# EAGLE schematic CAN Module (EAGLE 6.5.0)
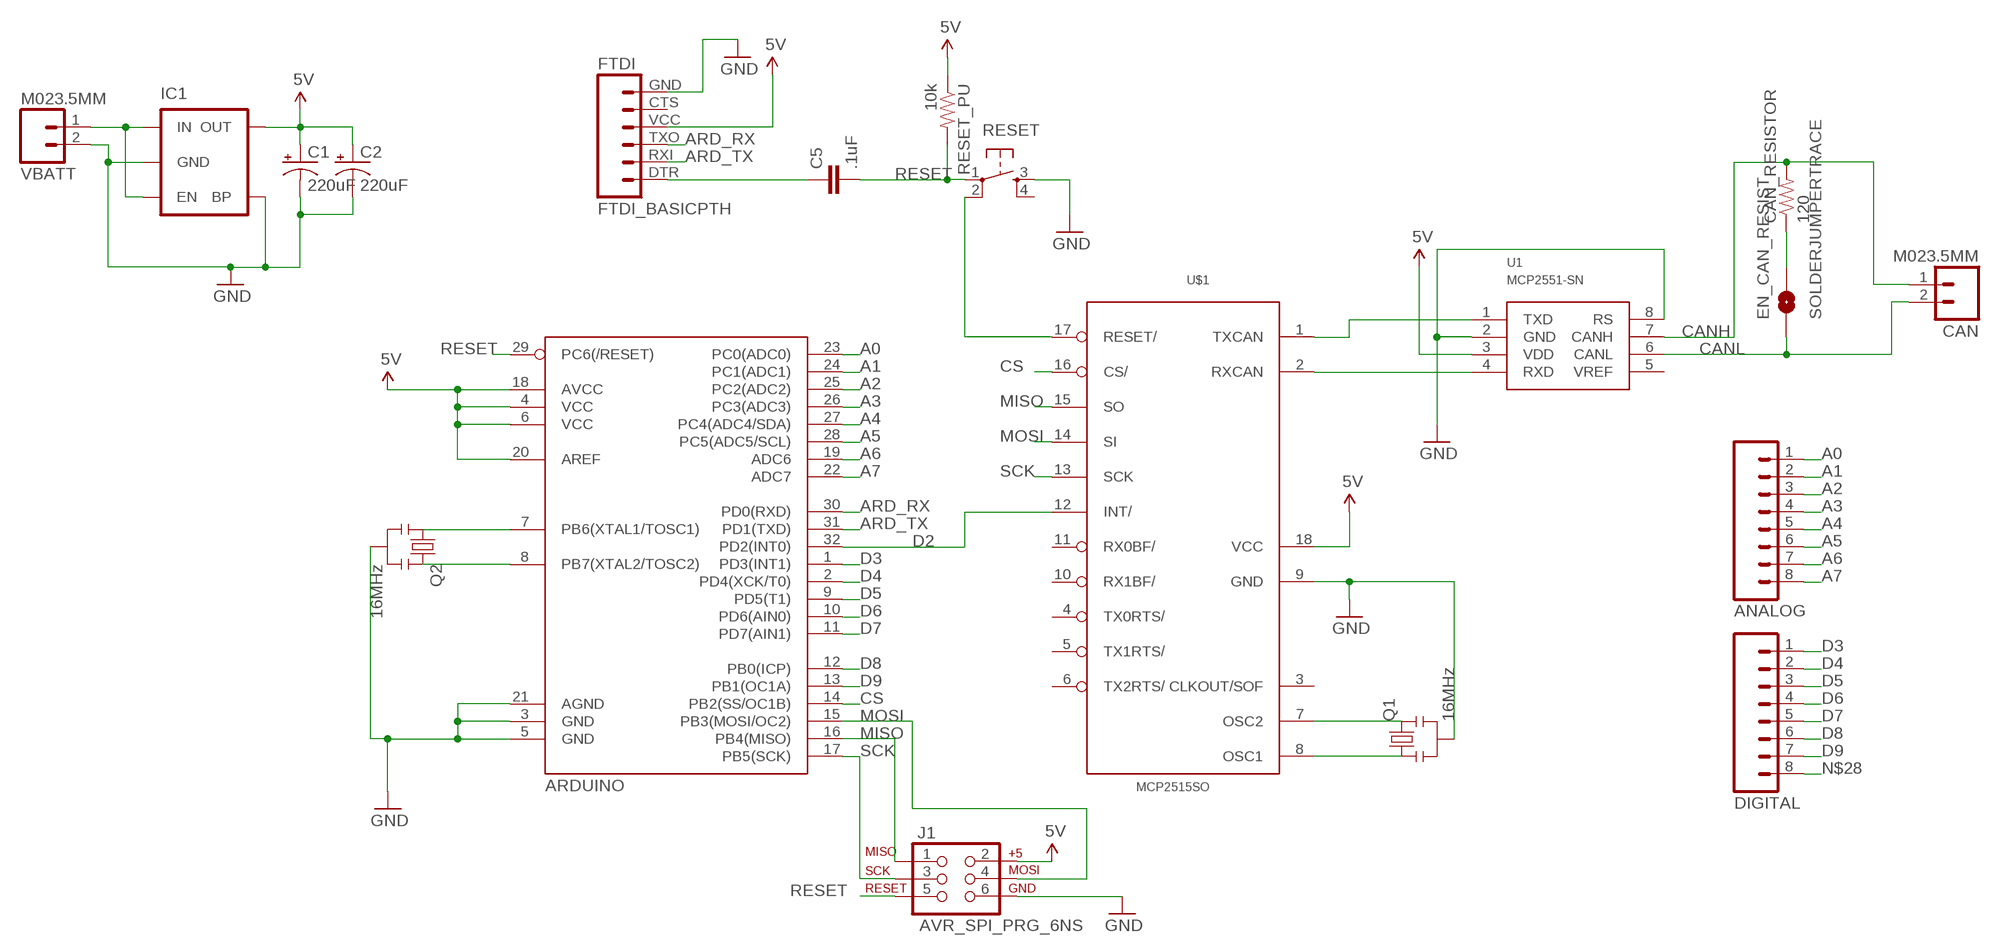
[diagram p0: schematic, sheet 1]

## Parts
ANALOG  M08LOCK  [1X08_LOCK]
ARDUINO  ATMEGA328_SMT  [TQFP32-08]
C1  220uF  CAP_POL1206-KIT  [EIA3216-KIT]
C2  220uF  CAP_POL1206-KIT  [EIA3216-KIT]
C5  .1uF  CAP0805  [0805]
CAN  M023.5MM  [SCREWTERMINAL-3.5MM-2]
CAN_RESISTOR  120  RESISTOR0805-RES  [0805]
DIGITAL  M08LOCK  [1X08_LOCK]
EN_CAN_RESIST  SOLDERJUMPERTRACE  [SJ_2S-TRACE]
FTDI  FTDI_BASICPTH  [FTDI_BASIC]
IC1  MIC52055V  [SOT23-5]
J1  AVR_SPI_PRG_6NS  [2X3-NS]
Q1  16MHz  RESONATOR16MHZ  [RESONATOR-SMD]
Q2  16MHz  RESONATOR16MHZ  [RESONATOR-SMD]
RESET  TAC_SWITCHSMD  [TACTILE_SWITCH_SMD]
RESET_PU  10k  RESISTOR0805-RES  [0805]
U1  MCP2551-SN  [SO-08]
U$1  MCP2515SO  [SO18L]
VBATT  M023.5MM  [SCREWTERMINAL-3.5MM-2]

## Nets
5V: ARDUINO.4(VCC) ARDUINO.6(VCC) ARDUINO.18(AVCC) ARDUINO.20(AREF) C1.A(+) C2.A(+) FTDI.VCC IC1.5(OUT) J1.2 RESET_PU.1 U1.3(VDD) U$1.18(VCC)
A0: ANALOG.1 ARDUINO.23(PC0(ADC0))
A1: ANALOG.2 ARDUINO.24(PC1(ADC1))
A2: ANALOG.3 ARDUINO.25(PC2(ADC2))
A3: ANALOG.4 ARDUINO.26(PC3(ADC3))
A4: ANALOG.5 ARDUINO.27(PC4(ADC4/SDA))
A5: ANALOG.6 ARDUINO.28(PC5(ADC5/SCL))
A6: ANALOG.7 ARDUINO.19(ADC6)
A7: ANALOG.8 ARDUINO.22(ADC7)
ARD_RX: ARDUINO.30(PD0(RXD)) FTDI.TXO
ARD_TX: ARDUINO.31(PD1(TXD)) FTDI.RXI
CANH: CAN.1 CAN_RESISTOR.2 U1.7(CANH)
CANL: CAN.2 EN_CAN_RESIST.1 U1.6(CANL)
CS: ARDUINO.14(PB2(SS/OC1B)) U$1.16(CS/)
D2: ARDUINO.32(PD2(INT0)) U$1.12(INT/)
D3: ARDUINO.1(PD3(INT1)) DIGITAL.1
D4: ARDUINO.2(PD4(XCK/T0)) DIGITAL.2
D5: ARDUINO.9(PD5(T1)) DIGITAL.3
D6: ARDUINO.10(PD6(AIN0)) DIGITAL.4
D7: ARDUINO.11(PD7(AIN1)) DIGITAL.5
D8: ARDUINO.12(PB0(ICP)) DIGITAL.6
D9: ARDUINO.13(PB1(OC1A)) DIGITAL.7
GND: ARDUINO.3(GND) ARDUINO.5(GND) ARDUINO.21(AGND) C1.C(-) C2.C(-) FTDI.GND IC1.2(GND) IC1.4(BP) J1.6 Q1.2 Q2.2 RESET.3 U1.2(GND) U1.8(RS) U$1.9(GND) VBATT.2
MISO: ARDUINO.16(PB4(MISO)) J1.1 U$1.15(SO)
MOSI: ARDUINO.15(PB3(MOSI/OC2)) J1.4 U$1.14(SI)
N$2: U1.4(RXD) U$1.2(RXCAN)
N$3: U1.1(TXD) U$1.1(TXCAN)
N$4: CAN_RESISTOR.1 EN_CAN_RESIST.2
N$8: RESET.2 U$1.17(RESET/)
N$9: ARDUINO.7(PB6(XTAL1/TOSC1)) Q2.1
N$10: ARDUINO.8(PB7(XTAL2/TOSC2)) Q2.3
N$11: C5.1 FTDI.DTR
N$12: Q1.3 U$1.7(OSC2)
N$13: Q1.1 U$1.8(OSC1)
N$14: IC1.1(IN) IC1.3(EN) VBATT.1
N$28: DIGITAL.8
RESET: ARDUINO.29(PC6(/RESET)) C5.2 J1.5 RESET.1 RESET_PU.2
SCK: ARDUINO.17(PB5(SCK)) J1.3 U$1.13(SCK)
Unconnected: FTDI.CTS RESET.4 U1.5(VREF) U$1.3(CLKOUT/SOF) U$1.4(TX0RTS/) U$1.5(TX1RTS/) U$1.6(TX2RTS/) U$1.10(RX1BF/) U$1.11(RX0BF/)

## Library data of the parts
ANALOG DIGITAL = SparkFun-Connectors:M08: Header 8 Standard 8-pin 0.1" header. Use with straight break away headers (SKU : PRT-00116), right angle break away headers (PRT-00553), swiss pins (PRT-00743), machine pins (PRT-00117), and female headers (PRT-00115).
ARDUINO = SparkFun-DigitalIC:ATMEGA328_SMT: 32-Pin Atmega328 part Commonly used on Arduino compatible boards Available in QFP and QFN packages TQFP is IC-09069 QFN is non-stock; PROD_ID: IC-09069; VALUE: ATMEGA328P
C1 C2 = SparkFun-Capacitors:CAP_POL: Capacitor Polarized These are standard SMD and PTH capacitors. Normally 10uF, 47uF, and 100uF in electrolytic and tantalum varieties. Always verify the external diameter of the through hole cap, it varies with capacity, voltage, and manufacturer. The EIA devices should be standard.
C5 = SparkFun-Capacitors:CAP: Capacitor Standard 0603 ceramic capacitor, and 0.1" leaded capacitor.
CAN VBATT = SparkFun-Connectors:M02: Standard 2-pin 0.1" header. Use with - straight break away headers ( PRT-00116) - right angle break away headers (PRT-00553) - swiss pins (PRT-00743) - machine pins (PRT-00117) - female headers (PRT-00115) Molex polarized connector foot print use with: PRT-08233 with associated crimp pins and housings. 2.54_SCREWTERM for use with PRT-10571. 3.5mm Screw Terminal footprints for PRT-08084 5mm Screw Terminal footprints for use with PRT-08433
CAN_RESISTOR RESET_PU = SparkFun-Resistors:RESISTOR: Resistor Basic schematic elements and footprints for 0603, 1206, and PTH resistors.
EN_CAN_RESIST = SparkFun-Passives:SOLDERJUMPER: Solder Jumper Standard SMD solder jumper. Used to automate production. Two varients : Normally Open and Normally Closed are the same, but have different paste layers. NC will have a large amount of paste and should jumper during reflow.
FTDI = SparkFun-Connectors:FTDI_BASIC: FTDI Basic header with labels
IC1 = SparkFun-PowerIC:MIC5205: MIC5205 150mA vreg 3.3V - VREG-00822 5V - VREG-00823; PROD_ID: VREG-00823
J1 = SparkFun-Connectors:AVR_SPI_PRG_6: AVR ISP 6 Pin This is the reduced ISP connector for AVR programming. Common on Arduino. This footprint will take up less PCB space and can be used with a 10-pin to 6-pin adapter such as SKU: BOB-08508
Q1 Q2 = SparkFun-FreqCtrl:RESONATOR: Resonator Small SMD resonator. Used, eg, on the Arduino Pro/ Pro Mini boards. 8MHz- XTAL-08895 16MHz- XTAL-08900; PROD_ID: XTAL-08900
RESET = SparkFun-Electromechanical:TAC_SWITCH: Momentary Switch Button commonly used for reset or general input. Spark Fun Electronics SKU : COM-00097 SMT- SWCH-08247; PROD_ID: SWCH-08247
U1 = MCP2551:MCP2551: Maciej Kalinowski maciek@chwarzno.pl
U$1 = MCP2515_MT:MCP2515*: MCP2515 Standalone CAN-Controller by Microchip Eagle-Lib. by MartinThomas

## Net classes
0 default: clearance 0.205 mm